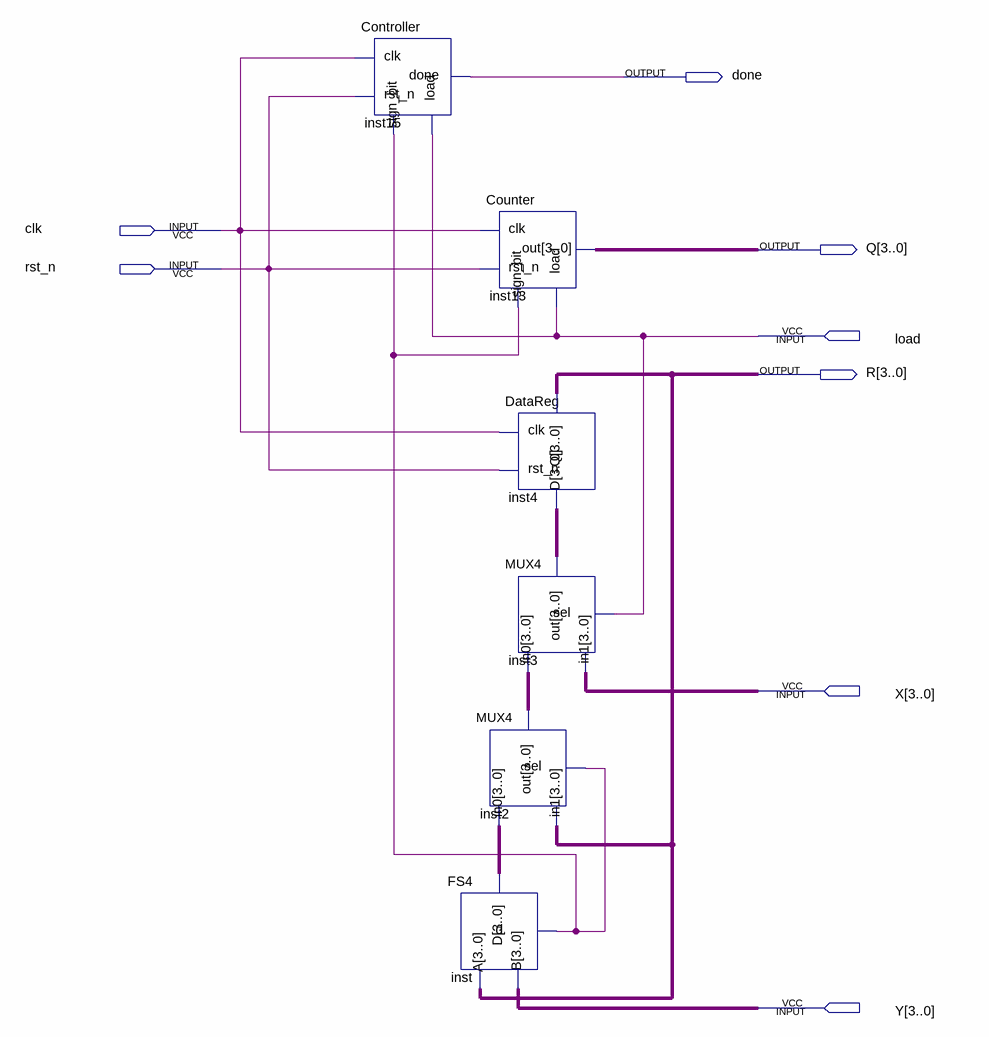
[diagram p0: schematic sheet]
// Quartus schematic DV4.bdf as structural Verilog: 6 symbols, 8 pins
module DV4 (
  input  clk,
  input  rst_n,
  input  load,
  input  [3:0] X,
  input  [3:0] Y,
  output done,
  output [3:0] Q,
  output [3:0] R
);

  wire inst_d;
  wire [3:0] inst2_out, inst3_out, inst_d_2;

  Controller inst15 (.clk(clk), .sign_bit(inst_d), .load(load), .rst_n(rst_n), .done(done));
  Counter inst13 (.clk(clk), .rst_n(rst_n), .load(load), .sign_bit(inst_d), .out(Q));
  DataReg inst4 (.clk(clk), .rst_n(rst_n), .D(inst3_out), .Q(R));
  MUX4 inst3 (.in0(inst2_out), .in1(X), .sel(load), .out(inst3_out));
  MUX4 inst2 (.in0(inst_d_2), .in1(R), .sel(inst_d), .out(inst2_out));
  FS4 inst (.A(R), .B(Y), .D(inst_d_2), .d(inst_d));
endmodule
